# Altium project MAGIsCoCore.PrjPcb
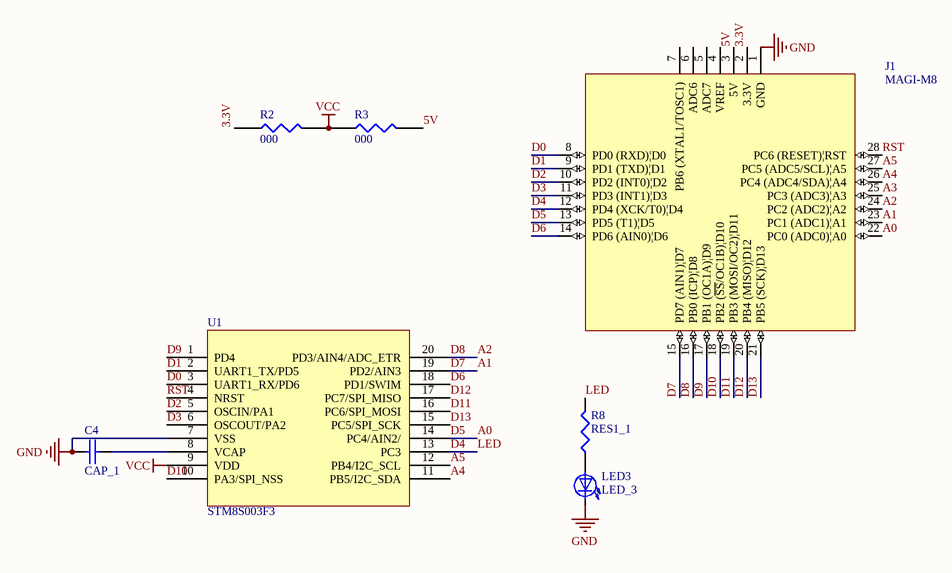
[diagram p0: MAGIsCoCore.SchDoc]
1 sheet, 7 parts. Net scope: global (net labels, ports and power ports of the same name join across sheets).
Board file: MAGIsCoCore.PcbDoc

## Sheet MAGIsCoCore.SchDoc
size A4

### Parts
C4  CAP_1  [6-0805_N]
J1  MAGI-M8  [MAGI-M8]
LED3  LED_3  [6-0805_N]
R2  000  [6-0805_n]
R3  000  [6-0805_n]
R8  RES1_1  [6-0805_N]
U1  STM8S003F3  [STM8S003F3]

### Nets
GND: C4.1 J1.1(GND) LED3.2(K) U1.7(VSS)
VCC: R2.2 R3.1 U1.9(VDD)
3.3V: J1.2(3.3V) R2.1
5V: J1.3(5V) R3.2
A0: J1.13(PD5_(T1)|D5) J1.22(PC0_(ADC0)|A0) U1.14(PC4/AIN2/)  [also labelled D5]
A1: J1.15(PD7_(AIN1)|D7) J1.23(PC1_(ADC1)|A1) U1.19(PD2/AIN3)  [also labelled D7]
A2: J1.16(PB0_(ICP)|D8) J1.24(PC2_(ADC2)|A2) U1.20(PD3/AIN4/ADC_ETR)  [also labelled D8]
A3: J1.25(PC3_(ADC3)|A3)
A4: J1.26(PC4_(ADC4/SDA)|A4) U1.11(PB5/I2C_SDA)
A5: J1.27(PC5_(ADC5/SCL)|A5) U1.12(PB4/I2C_SCL)
D0: J1.8(PD0_(RXD)|D0) U1.3(UART1_RX/PD6)
D1: J1.9(PD1_(TXD)|D1) U1.2(UART1_TX/PD5)
D2: J1.10(PD2_(INT0)|D2) U1.5(OSCIN/PA1)
D3: J1.11(PD3_(INT1)|D3) U1.6(OSCOUT/PA2)
D4: J1.12(PD4_(XCK/T0)|D4) R8.2 U1.13(PC3)  [also labelled LED]
D6: J1.14(PD6_(AIN0)|D6) U1.18(PD1/SWIM)
D9: J1.17(PB1_(OC1A)|D9) U1.1(PD4)
D10: J1.18(PB2_(~{SS}/OC1B)|D10) U1.10(PA3/SPI_NSS)
D11: J1.19(PB3_(MOSI/OC2)|D11) U1.16(PC6/SPI_MOSI)
D12: J1.20(PB4_(MISO)|D12) U1.17(PC7/SPI_MISO)
D13: J1.21(PB5_(SCK)|D13) U1.15(PC5/SPI_SCK)
RST: J1.28(PC6_(RESET)|RST) U1.4(NRST)
NetC4_2: C4.2 U1.8(VCAP)
NetLED3_1: LED3.1(A) R8.1

Not connected (* = marked no-connect by the designer): J1 4(VREF) 5(ADC7) 6(ADC6) 7(PB6_(XTAL1/TOSC1))

### Library data of the parts
C4 = CAP_1: Capacitor
R2 R3 = RES1